# EAGLE design PIC18f26k40_W5500_DevBoard (EAGLE 8.0.1)
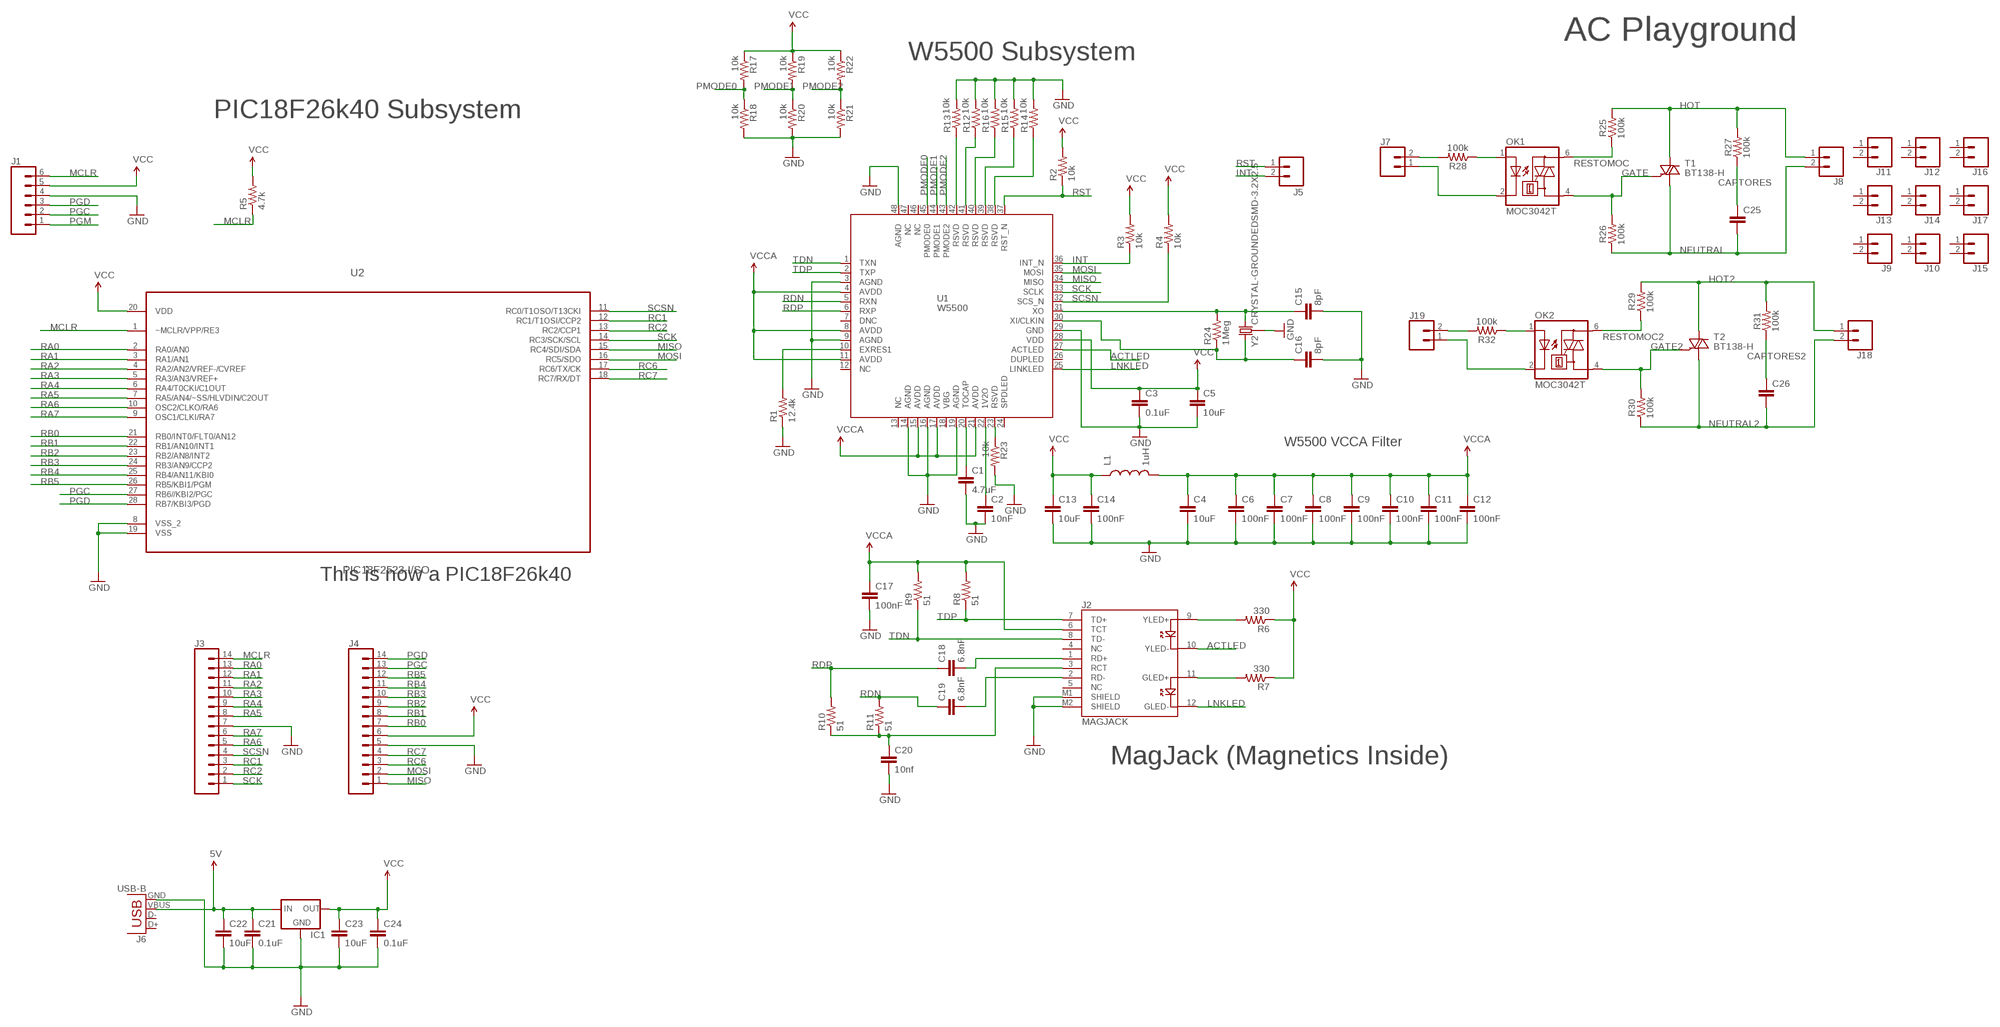
[diagram p0: schematic, sheet 1]

## Parts
C1  4.7uF  CAP0603-CAP  [0603-CAP]
C2  10nF  CAP0603-CAP  [0603-CAP]
C3  0.1uF  CAP0603-CAP  [0603-CAP]
C4  10uF  CAP0603-CAP  [0603-CAP]
C5  10uF  CAP0603-CAP  [0603-CAP]
C6  100nF  CAP0603-CAP  [0603-CAP]
C7  100nF  CAP0603-CAP  [0603-CAP]
C8  100nF  CAP0603-CAP  [0603-CAP]
C9  100nF  CAP0603-CAP  [0603-CAP]
C10  100nF  CAP0603-CAP  [0603-CAP]
C11  100nF  CAP0603-CAP  [0603-CAP]
C12  100nF  CAP0603-CAP  [0603-CAP]
C13  10uF  CAP0603-CAP  [0603-CAP]
C14  100nF  CAP0603-CAP  [0603-CAP]
C15  8pF  CAP0603-CAP  [0603-CAP]
C16  8pF  CAP0603-CAP  [0603-CAP]
C17  100nF  CAP0603-CAP  [0603-CAP]
C18  6.8nF  CAP0603-CAP  [0603-CAP]
C19  6.8nF  CAP0603-CAP  [0603-CAP]
C20  10nf  CAP0603-CAP  [0603-CAP]
C21  0.1uF  CAP0603-CAP  [0603-CAP]
C22  10uF  CAP0603-CAP  [0603-CAP]
C23  10uF  CAP0603-CAP  [0603-CAP]
C24  0.1uF  CAP0603-CAP  [0603-CAP]
C25  CAPPTH3  [CAP-PTH-LARGE]
C26  CAPPTH3  [CAP-PTH-LARGE]
IC1  78XXL  [78XXL]
J1  CONN_06NO_SILK_FEMALE_PTH  [1X06_NO_SILK]
J2  MAGJACK  [MAGJACK]
J3  CONN_14  [1X14]
J4  CONN_14  [1X14]
J5  M02PTH  [1X02@1]
J6  USB-B  USBPTH  [USB-B-PTH]
J7  CONN_02  [1X02]
J8  CONN_025MM  [SCREWTERMINAL-5MM-2]
J9  CONN_025MM  [SCREWTERMINAL-5MM-2]
J10  CONN_025MM  [SCREWTERMINAL-5MM-2]
J11  CONN_025MM  [SCREWTERMINAL-5MM-2]
J12  CONN_025MM  [SCREWTERMINAL-5MM-2]
J13  CONN_025MM  [SCREWTERMINAL-5MM-2]
J14  CONN_025MM  [SCREWTERMINAL-5MM-2]
J15  CONN_025MM  [SCREWTERMINAL-5MM-2]
J16  CONN_025MM  [SCREWTERMINAL-5MM-2]
J17  CONN_025MM  [SCREWTERMINAL-5MM-2]
J18  CONN_025MM  [SCREWTERMINAL-5MM-2]
J19  CONN_02  [1X02]
L1  1uH  INDUCTOR0603  [0603]
OK1  MOC3042T  [DIL06B]
OK2  MOC3042T  [DIL06B]
R1  12.4k  RESISTOR0603-RES  [0603-RES]
R2  10k  RESISTOR0603-RES  [0603-RES]
R3  10k  RESISTOR0603-RES  [0603-RES]
R4  10k  RESISTOR0603-RES  [0603-RES]
R5  4.7k  RESISTOR0603-RES  [0603-RES]
R6  330  RESISTOR0603-RES  [0603-RES]
R7  330  RESISTOR0603-RES  [0603-RES]
R8  51  RESISTOR0603-RES  [0603-RES]
R9  51  RESISTOR0603-RES  [0603-RES]
R10  51  RESISTOR0603-RES  [0603-RES]
R11  51  RESISTOR0603-RES  [0603-RES]
R12  10k  RESISTOR0603-RES  [0603-RES]
R13  10k  RESISTOR0603-RES  [0603-RES]
R14  10k  RESISTOR0603-RES  [0603-RES]
R15  10k  RESISTOR0603-RES  [0603-RES]
R16  10k  RESISTOR0603-RES  [0603-RES]
R17  10k  RESISTOR0603-RES  [0603-RES]
R18  10k  RESISTOR0603-RES  [0603-RES]
R19  10k  RESISTOR0603-RES  [0603-RES]
R20  10k  RESISTOR0603-RES  [0603-RES]
R21  10k  RESISTOR0603-RES  [0603-RES]
R22  10k  RESISTOR0603-RES  [0603-RES]
R23  10k  RESISTOR0603-RES  [0603-RES]
R24  1Meg  RESISTOR0603-RES  [0603-RES]
R25  100k  100KOHM-HORIZ-1/4W-1%  [AXIAL-0.3]
R26  100k  100KOHM-HORIZ-1/4W-1%  [AXIAL-0.3]
R27  100k  100KOHM-HORIZ-1/4W-1%  [AXIAL-0.3]
R28  100k  100KOHM-HORIZ-1/4W-1%  [AXIAL-0.3]
R29  100k  100KOHM-HORIZ-1/4W-1%  [AXIAL-0.3]
R30  100k  100KOHM-HORIZ-1/4W-1%  [AXIAL-0.3]
R31  100k  100KOHM-HORIZ-1/4W-1%  [AXIAL-0.3]
R32  100k  100KOHM-HORIZ-1/4W-1%  [AXIAL-0.3]
T1  BT138-H  [TO220BH]
T2  BT138-H  [TO220BH]
U1  W5500  [W5500]
U2  PIC18F2523-I/SO  [SOIC127P1030X265-28N]
Y2  CRYSTAL-GROUNDEDSMD-3.2X2.5  [CRYSTAL-SMD-3.2X2.5MM]

## Nets
5V: C21.1 C22.1 IC1.IN J6.VBUS
ACTLED: J2.10(YLED-) U1.27(ACTLED)
CAPTORES: C25.1 R27.P$1
CAPTORES2: C26.1 R31.P$1
GATE: OK1.4(A1) R26.P$2 T1.G
GATE2: OK2.4(A1) R30.P$2 T2.G
GND: C1.2 C2.2 C3.2 C4.2 C5.2 C6.2 C7.2 C8.2 C9.2 C10.2 C11.2 C12.2 C13.2 C14.2 C15.2 C16.2 C17.2 C20.2 C21.2 C22.2 C23.2 C24.2 IC1.GND J1.4 J2.M1(SHIELD) J2.M2(SHIELD) J3.7 J4.5 J6.GND R1.1 R12.2 R13.2 R14.2 R15.2 R16.2 R18.2 R20.2 R21.2 R23.2 U1.3(AGND) U1.9(AGND) U1.14(AGND) U1.16(AGND) U1.19(AGND) U1.29(GND) U1.48(AGND) U2.8(VSS_2) U2.19(VSS) Y2.2 Y2.4
HOT: J8.1 R25.P$2 R27.P$2 T1.T2(A2)
HOT2: J18.1 R29.P$2 R31.P$2 T2.T2(A2)
INT: J5.2 R3.1 U1.36(INT_N)
LNKLED: J2.12(GLED-) U1.25(LINKLED)
MCLR: J1.6 J3.14 R5.1 U2.1(~MCLR/VPP/RE3)
MISO: J4.1 U1.34(MISO) U2.15(RC4/SDI/SDA)
MOSI: J4.2 U1.35(MOSI) U2.16(RC5/SDO)
N$1: C1.1 U1.20(TOCAP)
N$2: C2.1 U1.22(1V2O)
N$3: R12.1 U1.41(RSVD)
N$4: R1.2 U1.10(EXRES1)
N$5: J7.2 R28.P$2
N$6: C15.1 R24.2 U1.31(XO) Y2.3
N$7: J2.9(YLED+) R6.2
N$8: C18.2 J2.1(RD+)
N$9: J2.11(GLED+) R7.2
N$10: C19.2 J2.2(RD-)
N$11: C20.1 J2.3(RCT) R10.1 R11.1
N$12: R14.1 U1.38(RSVD)
N$13: R15.1 U1.39(RSVD)
N$14: R16.1 U1.40(RSVD)
N$15: R13.1 U1.42(RSVD)
N$16: R23.1 U1.23(RSVD)
N$17: C16.1 R24.1 U1.30(XI/CLKIN) Y2.1
N$18: OK1.1(A) R28.P$1
N$19: J7.1 OK1.2(C)
N$20: J19.2 R32.P$2
N$21: OK2.1(A) R32.P$1
N$22: J19.1 OK2.2(C)
NEUTRAL: C25.2 J8.2 R26.P$1 T1.T1(A1)
NEUTRAL2: C26.2 J18.2 R30.P$1 T2.T1(A1)
PGC: J1.2 J4.13 U2.27(RB6//KBI2/PGC)
PGD: J1.3 J4.14 U2.28(RB7/KBI3/PGD)
PGM: J1.1
PMODE0: R17.2 R18.1 U1.45(PMODE0)
PMODE1: R19.2 R20.1 U1.44(PMODE1)
PMODE2: R21.1 R22.2 U1.43(PMODE2)
RA0: J3.13 U2.2(RA0/AN0)
RA1: J3.12 U2.3(RA1/AN1)
RA2: J3.11 U2.4(RA2/AN2/VREF-/CVREF)
RA3: J3.10 U2.5(RA3/AN3/VREF+)
RA4: J3.9 U2.6(RA4/T0CKI/C1OUT)
RA5: J3.8 U2.7(RA5/AN4/~SS/HLVDIN/C2OUT)
RA6: J3.5 U2.10(OSC2/CLKO/RA6)
RA7: J3.6 U2.9(OSC1/CLKI/RA7)
RB0: J4.7 U2.21(RB0/INT0/FLT0/AN12)
RB1: J4.8 U2.22(RB1/AN10/INT1)
RB2: J4.9 U2.23(RB2/AN8/INT2)
RB3: J4.10 U2.24(RB3/AN9/CCP2)
RB4: J4.11 U2.25(RB4/AN11/KBI0)
RB5: J4.12 U2.26(RB5/KBI1/PGM)
RC1: J3.3 U2.12(RC1/T1OSI/CCP2)
RC2: J3.2 U2.13(RC2/CCP1)
RC6: J4.3 U2.17(RC6/TX/CK)
RC7: J4.4 U2.18(RC7/RX/DT)
RDN: C19.1 R11.2 U1.5(RXN)
RDP: C18.1 R10.2 U1.6(RXP)
RESTOMOC: OK1.6(A2) R25.P$1
RESTOMOC2: OK2.6(A2) R29.P$1
RST: J5.1 R2.1 U1.37(RST_N)
SCK: J3.1 U1.33(SCLK) U2.14(RC3/SCK/SCL)
SCSN: J3.4 R4.1 U1.32(SCS_N) U2.11(RC0/T1OSO/T13CKI)
TDN: J2.8(TD-) R9.1 U1.1(TXN)
TDP: J2.7(TD+) R8.1 U1.2(TXP)
VCC: C3.1 C5.1 C13.1 C14.1 C23.1 C24.1 IC1.OUT J1.5 J4.6 L1.1 R2.2 R3.2 R4.2 R5.2 R6.1 R7.1 R17.1 R19.1 R22.1 U1.28(VDD) U2.20(VDD)
VCCA: C4.1 C6.1 C7.1 C8.1 C9.1 C10.1 C11.1 C12.1 C17.1 J2.6(TCT) L1.2 R8.2 R9.2 U1.4(AVDD) U1.8(AVDD) U1.11(AVDD) U1.15(AVDD) U1.17(AVDD) U1.21(AVDD)
Unconnected: J2.4(NC) J2.5(NC) J6.D+ J6.D- J9.1 J9.2 J10.1 J10.2 J11.1 J11.2 J12.1 J12.2 J13.1 J13.2 J14.1 J14.2 J15.1 J15.2 J16.1 J16.2 J17.1 J17.2 U1.7(DNC) U1.12(NC) U1.13(NC) U1.18(VBG) U1.24(SPDLED) U1.26(DUPLED) U1.46(NC) U1.47(NC)

## Notes on the sheet
- AC Playground
- W5500 Subsystem
- PIC18F26k40 Subsystem
- W5500 VCCA Filter
- This is now a PIC18F26k40
- MagJack (Magnetics Inside)

## Library data of the parts
C1-C24 = SparkFun-Passives:CAP: Capacitor Standard 0603 ceramic capacitor, and 0.1" leaded capacitor.
C25 C26 = SparkFun-Capacitors:CAP: Capacitor Standard 0603 ceramic capacitor, and 0.1" leaded capacitor.
IC1 = v-reg:78XXL: VOLTAGE REGULATOR
J1 = SparkFun-Connectors:CONN_06: Multi connection point. Often used as Generic Header-pin footprint for 0.1 inch spaced/style header connections On any of the 0.1 inch spaced packages, you can populate with these: Break Away Headers - Straight <https://www.sparkfun.com/products/116> (PRT-00116) Break Away Male Headers - Right Angle <https://www.sparkfun.com/products/553> (PRT-00553) Female Headers <https://www.sparkfun.com/products/115> (PRT-00115) Break Away Headers - Machine Pin <https://www.sparkfun.com/products/117> (PRT-00117) Break Away Female Headers - Swiss Machine Pin <https://www.sparkfun.com/products/743> (PRT-00743) Arduino Stackable Header - 6 Pin <https://www.sparkfun.com/products/9280> (PRT-09280) For SCREWTERMINALS and SPRING TERMINALS visit here: Screw Terimnals on SparkFun.com <https://www.sparkfun.com/search/results?term=Screw+Terminals> (5mm/3.5mm/2.54mm spacing) This device is also useful as a general connection point to wire up your design to another part of your project. Our various solder wires solder well into these plated through hole pads. Hook-Up Wire - Assortment (Stranded, 22 AWG) <https://www.sparkfun.com/products/11375> (PRT-11375) Hook-Up Wire - Assortment (Solid Core, 22 AWG) <https://www.sparkfun.com/products/11367> (PRT-11367) View the entire wire category on our website here <https://www.sparkfun.com/categories/141>; PROD_ID: CONN-08437
J2 = SparkFun-Connectors:MAGJACK: MAGJACK: RJ-45 with LEDs This is a single port, RJ45 ethernet jacks with built in transformer (magnetics), status LEDs, and shielding. Here is the connector we sell at SparkFun: RJ45 Ethernet MagJack-Compatible <https://www.sparkfun.com/products/8534> (PRT-08534) Datasheet <http://www.sparkfun.com/datasheets/Prototyping/MagJack.pdf> It is used on this SparkFun product: SparkFun RJ45 MagJack Breakout <https://www.sparkfun.com/products/13021> (BOB-13021); PROD_ID: CONN-09556; SF_ID: PRT-08534
J3 J4 = SparkFun-Connectors:CONN_14: Multi connection point. Often used as Generic Header-pin footprint for 0.1 inch spaced/style header connections On any of the 0.1 inch spaced packages, you can populate with these: Break Away Headers - Straight <https://www.sparkfun.com/products/116> (PRT-00116) Break Away Male Headers - Right Angle <https://www.sparkfun.com/products/553> (PRT-00553) Female Headers <https://www.sparkfun.com/products/115> (PRT-00115) Break Away Headers - Machine Pin <https://www.sparkfun.com/products/117> (PRT-00117) Break Away Female Headers - Swiss Machine Pin <https://www.sparkfun.com/products/743> (PRT-00743) For SCREWTERMINALS and SPRING TERMINALS visit here: Screw Terimnals on SparkFun.com <https://www.sparkfun.com/search/results?term=Screw+Terminals> (5mm/3.5mm/2.54mm spacing) This device is also useful as a general connection point to wire up your design to another part of your project. Our various solder wires solder well into these plated through hole pads. Hook-Up Wire - Assortment (Stranded, 22 AWG) <https://www.sparkfun.com/products/11375> (PRT-11375) Hook-Up Wire - Assortment (Solid Core, 22 AWG) <https://www.sparkfun.com/products/11367> (PRT-11367) View the entire wire category on our website here <https://www.sparkfun.com/categories/141> Special notes: Molex polarized connector foot print use with SKU : PRT-08231 with associated crimp pins and housings. 1MM SMD Version SKU: PRT-10208 NOTES ON THE VARIANTS LOCK and LOCK_LONGPADS... This footprint was designed to help hold the alignment of a through-hole component (i.e. 6-pin header) while soldering it into place. You may notice that each hole has been shifted either up or down by 0.005 of an inch from it's more standard position (which is a perfectly straight line). This slight alteration caused the pins (the squares in the middle) to touch the edges of the holes. Because they are alternating, it causes a "brace" to hold the component in place. 0.005 has proven to be the perfect amount of "off-center" position when using our standard breakaway headers. Although looks a little odd when you look at the bare footprint, once you have a header in there, the alteration is very hard to notice. Also,if you push a header all the way into place, it is covered up entirely on the bottom side.
J5 = SparkFun-Connectors:M02: Standard 2-pin 0.1" header. Use with - straight break away headers ( PRT-00116) - right angle break away headers (PRT-00553) - swiss pins (PRT-00743) - machine pins (PRT-00117) - female headers (PRT-00115) Molex polarized connector foot print use with: PRT-08233 with associated crimp pins and housings. 2.54_SCREWTERM for use with PRT-10571. 3.5mm Screw Terminal footprints for PRT-08084 5mm Screw Terminal footprints for use with PRT-08432
J6 = SparkFun-Connectors:USB: USB Connectors USB-B-PTH is fully proven SKU : PRT-00139/CONN-08278 USB-miniB is fully proven SKU : PRT-00587 USB-A-PCB is untested. USB-A-H is throughly reviewed, but untested. Spark Fun Electronics SKU : PRT-00437 USB-B-SMT is throughly reviewed, but untested. Needs silkscreen touching up. USB-A-S has not been used/tested USB-MB-H has not been used/tested USB-MICROB has been used. CONN-09505; PROD_ID: CONN-08278
J7 J19 = SparkFun-Connectors:CONN_02: Multi connection point. Often used as Generic Header-pin footprint for 0.1 inch spaced/style header connections On any of the 0.1 inch spaced packages, you can populate with these: Break Away Headers - Straight <https://www.sparkfun.com/products/116> (PRT-00116) Break Away Male Headers - Right Angle <https://www.sparkfun.com/products/553> (PRT-00553) Female Headers <https://www.sparkfun.com/products/115> (PRT-00115) Break Away Headers - Machine Pin <https://www.sparkfun.com/products/117> (PRT-00117) Break Away Female Headers - Swiss Machine Pin <https://www.sparkfun.com/products/743> (PRT-00743) For SCREWTERMINALS and SPRING TERMINALS visit here: Screw Terimnals on SparkFun.com <https://www.sparkfun.com/search/results?term=Screw+Terminals> (5mm/3.5mm/2.54mm spacing) This device is also useful as a general connection point to wire up your design to another part of your project. Our various solder wires solder well into these plated through hole pads. Hook-Up Wire - Assortment (Stranded, 22 AWG) <https://www.sparkfun.com/products/11375> (PRT-11375) Hook-Up Wire - Assortment (Solid Core, 22 AWG) <https://www.sparkfun.com/products/11367> (PRT-11367) View the entire wire category on our website here <https://www.sparkfun.com/categories/141> Special notes: Molex polarized connector foot print use with: PRT-08233 with associated crimp pins and housings. 2.54_SCREWTERM for use with PRT-10571. 3.5mm Screw Terminal footprints for PRT-08084 5mm Screw Terminal footprints for use with PRT-08432
J8-J18 = SparkFun-Connectors:CONN_02: Multi connection point. Often used as Generic Header-pin footprint for 0.1 inch spaced/style header connections On any of the 0.1 inch spaced packages, you can populate with these: Break Away Headers - Straight <https://www.sparkfun.com/products/116> (PRT-00116) Break Away Male Headers - Right Angle <https://www.sparkfun.com/products/553> (PRT-00553) Female Headers <https://www.sparkfun.com/products/115> (PRT-00115) Break Away Headers - Machine Pin <https://www.sparkfun.com/products/117> (PRT-00117) Break Away Female Headers - Swiss Machine Pin <https://www.sparkfun.com/products/743> (PRT-00743) For SCREWTERMINALS and SPRING TERMINALS visit here: Screw Terimnals on SparkFun.com <https://www.sparkfun.com/search/results?term=Screw+Terminals> (5mm/3.5mm/2.54mm spacing) This device is also useful as a general connection point to wire up your design to another part of your project. Our various solder wires solder well into these plated through hole pads. Hook-Up Wire - Assortment (Stranded, 22 AWG) <https://www.sparkfun.com/products/11375> (PRT-11375) Hook-Up Wire - Assortment (Solid Core, 22 AWG) <https://www.sparkfun.com/products/11367> (PRT-11367) View the entire wire category on our website here <https://www.sparkfun.com/categories/141> Special notes: Molex polarized connector foot print use with: PRT-08233 with associated crimp pins and housings. 2.54_SCREWTERM for use with PRT-10571. 3.5mm Screw Terminal footprints for PRT-08084 5mm Screw Terminal footprints for use with PRT-08432; SF_SKU: PRT-08432
L1 = SparkFun-Passives:INDUCTOR: Inductors Basic Inductor/Choke - 0603 and 1206. Footprints are not proven and vary greatly between part numbers. INDUCTOR POWER 3.3UH 4.0A SMD 0.197" L x 0.197" W x 0.177" H (5.00mm x 5.00mm x 4.50mm)
OK1 OK2 = optocoupler:MOC30*: 6-Pin DIP Zero-Cross Optoisolators Triac Driver Output (250/400 Volt Peak) Source: Data sheet <http://www.fairchildsemi.com/ds/MO/MOC3031M.pdf> The old path of data sheet not more available 2013-05-06.; OC_FARNELL: unknown; OC_NEWARK: unknown
R1-R24 = SparkFun-Passives:RESISTOR: Resistor Basic schematic elements and footprints for 0603, 1206, and PTH resistors.
R25-R32 = SparkFun-Resistors:100KOHM: 100kΩ resistor A resistor is a passive two-terminal electrical component that implements electrical resistance as a circuit element. Resistors act to reduce current flow, and, at the same time, act to lower voltage levels within circuits. - Wikipedia; PROD_ID: RES-12184
T1 T2 = triac:BT138: TRIAC Source: http://www.semiconductors.philips.com BT138_SERIES_2.pdf
U1 = W5500:W5500
U2 = Microchip_By_element14_Batch_1:PIC18F2523-I/SO: Enhanced Flash Microcontroller; MPN: PIC18F2523-I/SO; OC_FARNELL: 1332244; OC_NEWARK: 88K5996; PACKAGE: SOIC-28; SUPPLIER: Microchip
Y2 = SparkFun-Clocks:CRYSTAL-GROUNDED: Crystals w/ Ground Pin (Generic) These are passive quartz crystals, which can be used as a clock source for a microcontroller. Crystal's are usually two-terminal devices. A third terminal may be optionally connected to ground, as recommended by the manufaturer.

## Board
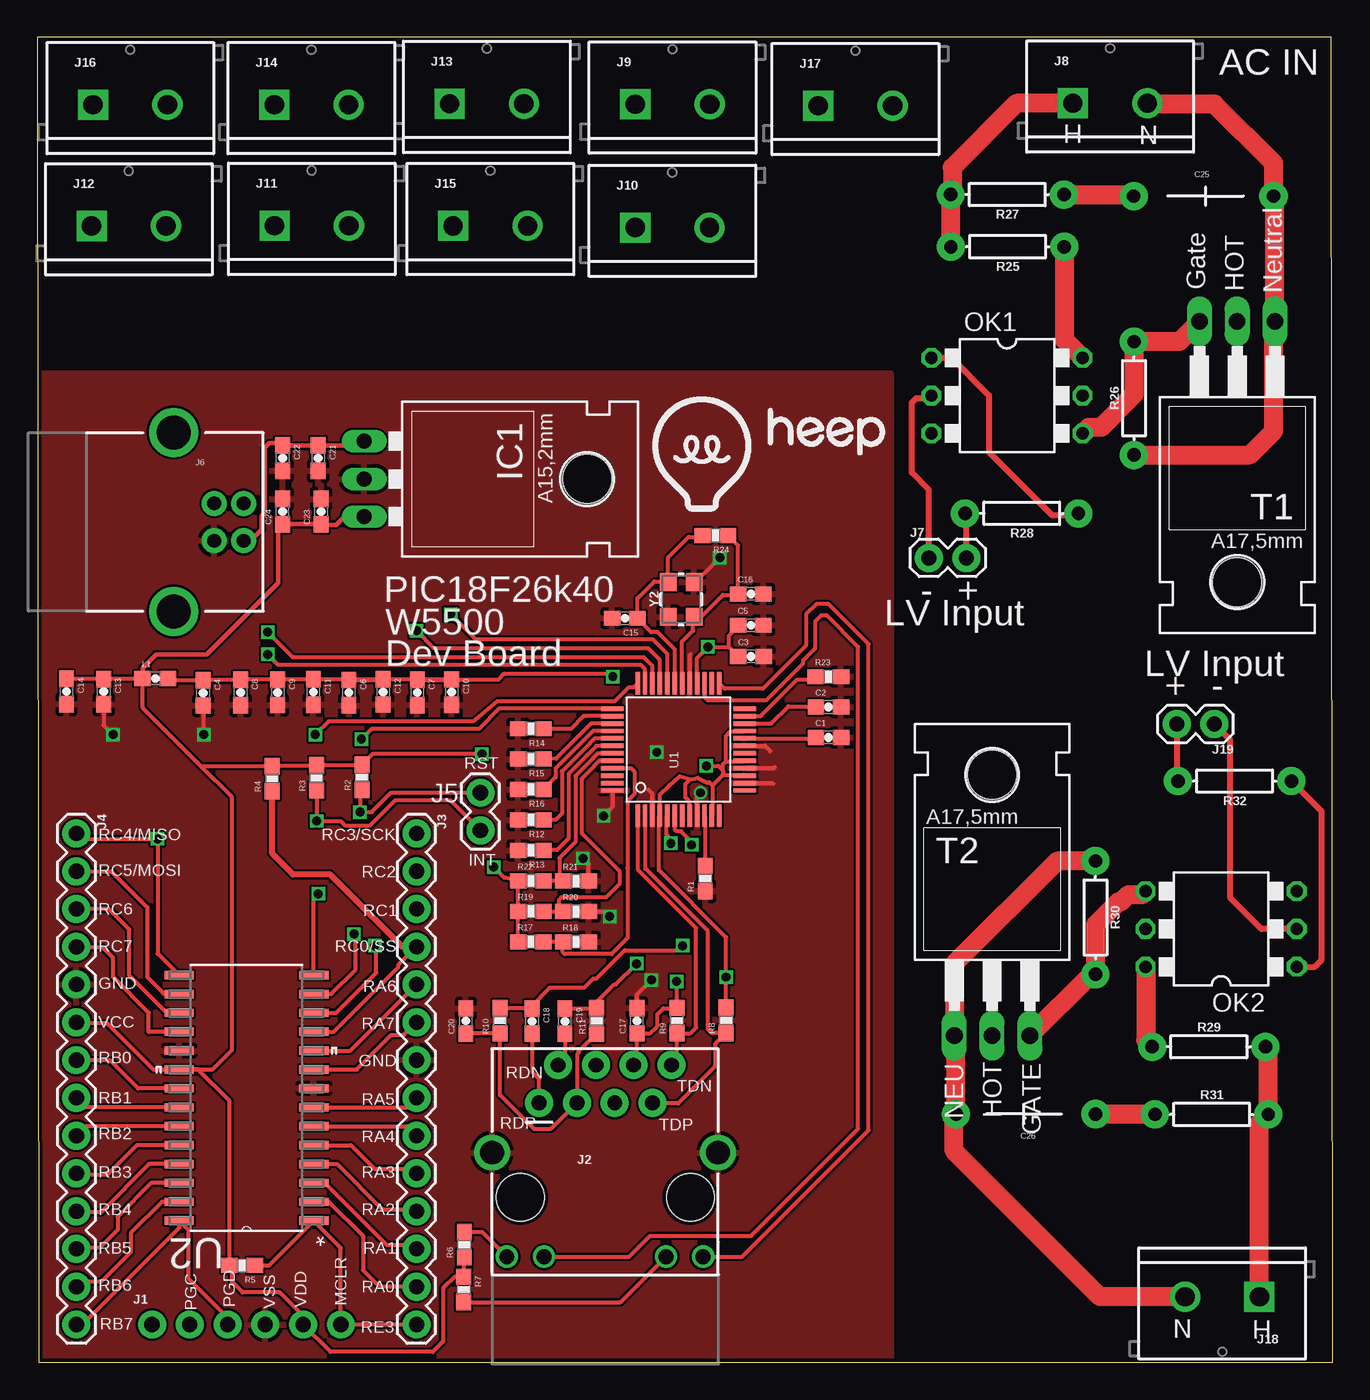
[diagram p1: board, top side]
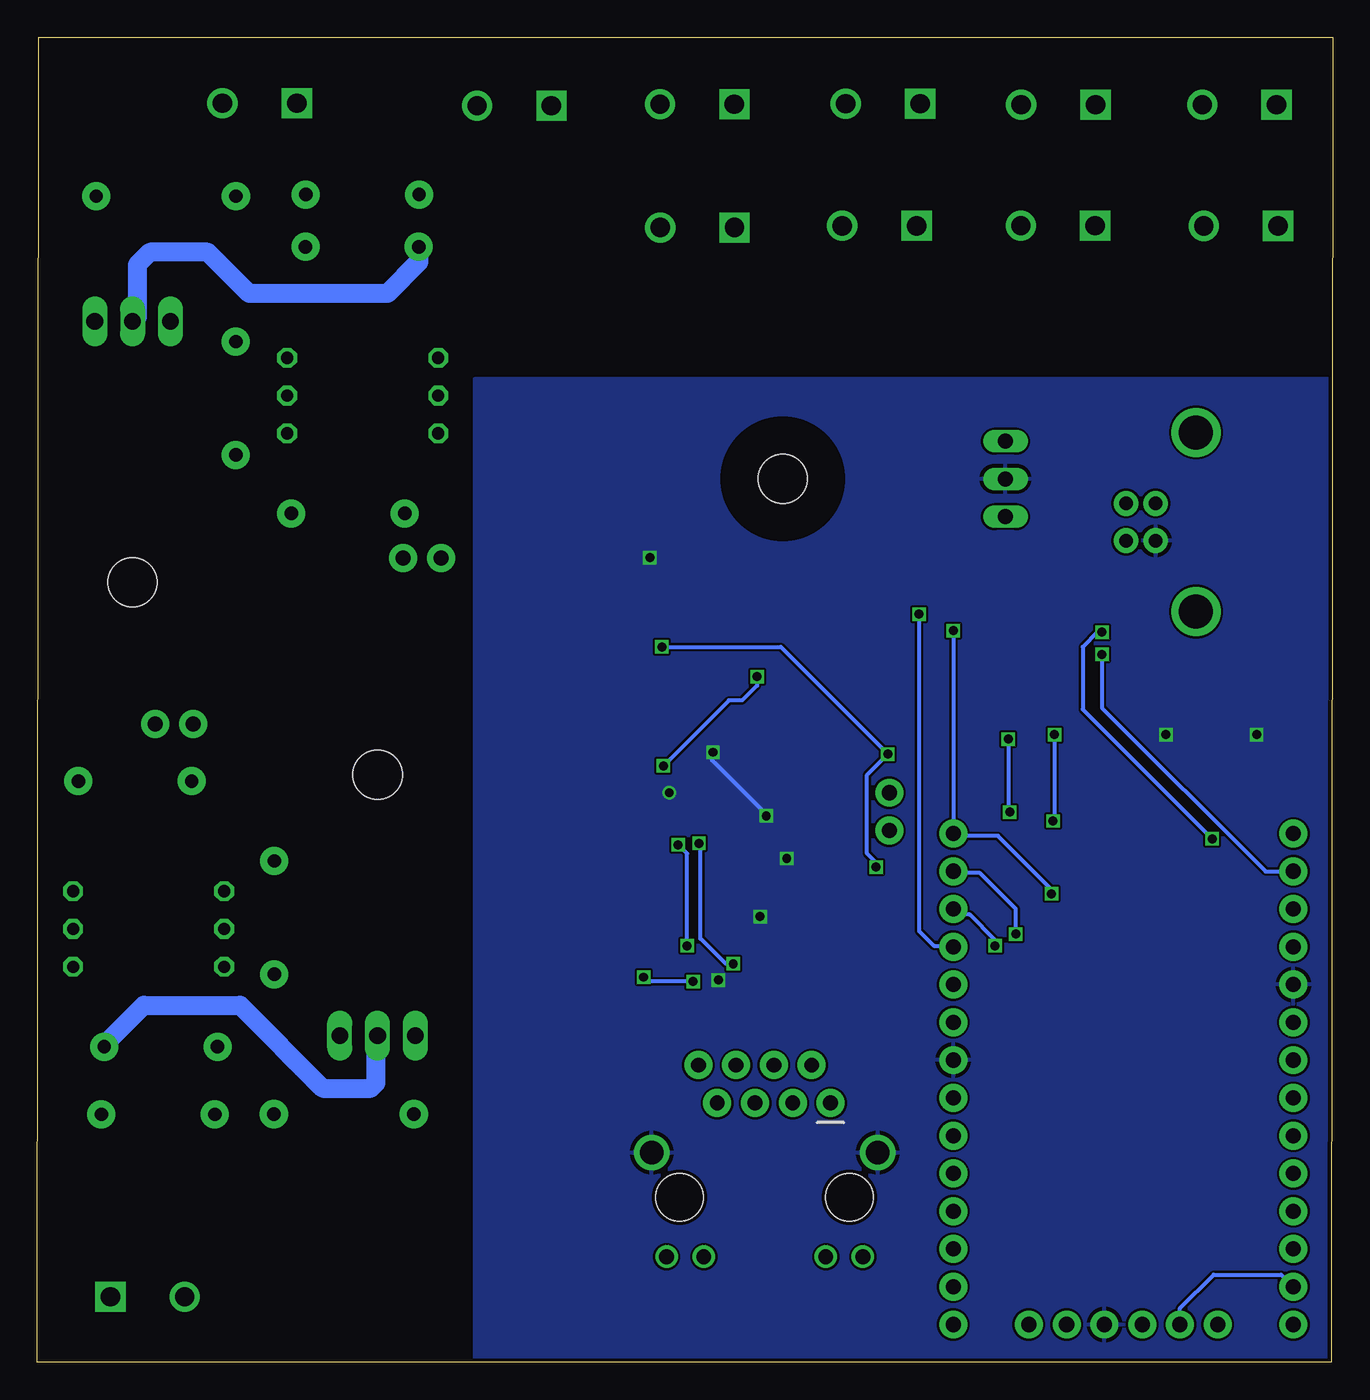
[diagram p2: board, bottom side, seen from below]

Size 87.1 x 89.1 mm. Coordinates in mm from the lower left corner, seen from the top.
Outline: 0.1,0 87.1,0 87,89.1 0,89.1 0.1,0
Copper layers (1*16): Top 0.035mm / dielectric 1.5mm / Bottom 0.035mm
Design rules "SeeedStudio_2layer_DRU_no_angle_20140221": minimum track width 6mil, minimum drill 12mil, track to track 6mil, track to pad 6mil, pad to pad 6mil, via to via 6mil, smd to smd 0mil, copper to edge 10mil, drill to drill 10mil, minimum pad ring 10mil, minimum via ring 6mil, stop-mask expansion 2mil, vias tented up to drill 100mil, thermal gap 10mil

### Footprints (pad centres in the part's own frame; a part is rotated, then mirrored left to right if it is on the bottom)
0603-CAP = smd 1.1 x 1: 1 -0.85,0; 2 0.85,0
CAP-PTH-LARGE = drill 0.9 pad 1.905: 1 -4.826,0; 2 4.572,0
78XXL = drill 1.016 long: GND 0,-3.81; IN -2.54,-3.81; OUT 2.54,-3.81 | hole 3.302: 0,11.176
1X06_NO_SILK = drill 1.016 pad 1.88: 1 0,0; 2 2.54,0; 3 5.08,0; 4 7.62,0; 5 10.16,0; 6 12.7,0
MAGJACK = drill 1 pad 1.88: 1 3.175,17.445; 2 4.445,19.985; 3 5.715,17.445; 4 6.985,19.985; 5 8.255,17.445; 6 9.525,19.985; 7 10.795,17.445; 8 12.065,19.985 | drill 1 pad 1.27: 9 1,7.1; 10 3.5,7.1; 11 11.7,7.1; 12 14.2,7.1 | drill 1.6 pad 2.184: M1 0,14.1; M2 15.2,14.1 | hole 3.2: 1.905,11.095; 13.335,11.095
1X14 = drill 1.016 pad 1.88: 1 0,0; 2 2.54,0; 3 5.08,0; 4 7.62,0; 5 10.16,0; 6 12.7,0; 7 15.24,0; 8 17.78,0; 9 20.32,0; 10 22.86,0; 11 25.4,0; 12 27.94,0; 13 30.48,0; 14 33.02,0
1X02@1 = drill 1.016 pad 1.88: 1 0,0; 2 2.54,0
USB-B-PTH = drill 0.914 pad 1.676: D+ 0,1.25; D- 1.981,1.25; GND 0,-1.25; VBUS 1.981,-1.25 | drill 2.286: S1 -2.718,-6.02; S2 -2.718,6.02
1X02 = drill 1.016 pad 1.88: 1 0,0; 2 2.54,0
SCREWTERMINAL-5MM-2 = drill 1.3 pad 2.032 square: 1 0,0 | drill 1.3 pad 2.032: 2 5,0
0603 = smd 1.1 x 1: 1 -0.85,0; 2 0.85,0
DIL06B = drill 0.813 octagon: 1 -2.54,-5.08; 2 0,-5.08; 3 2.54,-5.08; 4 2.54,5.08; 5 0,5.08; 6 -2.54,5.08
0603-RES = smd 1.1 x 1: 1 -0.85,0; 2 0.85,0
AXIAL-0.3 = drill 0.9 pad 1.88: P$1 -3.81,0; P$2 3.81,0
TO220BH = drill 1.118 long: G 2.54,-6.35; T1 -2.54,-6.35; T2 0,-6.35 | hole 3.302: 0,11.176
W5500 = smd 1.5 x 0.3: 1 -4.45,2.75; 2 -4.45,2.25; 3 -4.45,1.75; 4 -4.45,1.25; 5 -4.45,0.75; 6 -4.45,0.25; 7 -4.45,-0.25; 8 -4.45,-0.75; 9 -4.45,-1.25; 10 -4.45,-1.75; 11 -4.45,-2.25; 12 -4.45,-2.75; 25 4.45,-2.75; 26 4.45,-2.25; 27 4.45,-1.75; 28 4.45,-1.25; 29 4.45,-0.75; 30 4.45,-0.25; 31 4.45,0.25; 32 4.45,0.75; 33 4.45,1.25; 34 4.45,1.75; 35 4.45,2.25; 36 4.45,2.75 | smd 0.3 x 1.5: 13 -2.75,-4.45; 14 -2.25,-4.45; 15 -1.75,-4.45; 16 -1.25,-4.45; 17 -0.75,-4.45; 18 -0.25,-4.45; 19 0.25,-4.45; 20 0.75,-4.45; 21 1.25,-4.45; 22 1.75,-4.45; 23 2.25,-4.45; 24 2.75,-4.45; 37 2.75,4.45; 38 2.25,4.45; 39 1.75,4.45; 40 1.25,4.45; 41 0.75,4.45; 42 0.25,4.45; 43 -0.25,4.45; 44 -0.75,4.45; 45 -1.25,4.45; 46 -1.75,4.45; 47 -2.25,4.45; 48 -2.75,4.45
SOIC127P1030X265-28N = smd 1.981 x 0.559: 1 -4.521,8.255; 2 -4.521,6.985; 3 -4.521,5.715; 4 -4.521,4.445; 5 -4.521,3.175; 6 -4.521,1.905; 7 -4.521,0.635; 8 -4.521,-0.635; 9 -4.521,-1.905; 10 -4.521,-3.175; 11 -4.521,-4.445; 12 -4.521,-5.715; 13 -4.521,-6.985; 14 -4.521,-8.255; 15 4.521,-8.255; 16 4.521,-6.985; 17 4.521,-5.715; 18 4.521,-4.445; 19 4.521,-3.175; 20 4.521,-1.905; 21 4.521,-0.635; 22 4.521,0.635; 23 4.521,1.905; 24 4.521,3.175; 25 4.521,4.445; 26 4.521,5.715; 27 4.521,6.985; 28 4.521,8.255
CRYSTAL-SMD-3.2X2.5MM = smd 1.2 x 1.1: 1 -1.175,-0.875; 2 1.175,-0.875; 3 1.175,0.875; 4 -1.175,0.875

### Placement (x,y rotation side)
C1  53.21,42.02 0 top
C2  53.21,44.06 0 top
C3  48,47.46 0 top
C4  11.16,45.01 270 top
C5  47.98,49.56 0 top
C6  20.96,45.03 270 top
C7  25.56,45.04 270 top
C8  13.67,45.04 270 top
C9  16.17,45.05 270 top
C10  27.87,45.06 270 top
C11  18.57,45.07 270 top
C12  23.27,45.08 270 top
C13  4.47,45.09 270 top
C14  1.97,45.1 270 top
C15  39.51,50.03 180 top
C16  47.98,51.67 0 top
C17  40.33,22.97 90 top
C18  33.27,22.94 270 top
C19  35.48,22.94 270 top
C20  28.82,22.95 90 top
C21  18.9,60.8 270 top
C22  16.5,60.8 270 top
C23  19.1,57.2 90 top
C24  16.5,57.2 90 top
C25  78.56,78.41 0 top
C26  66.35,16.7 180 top
IC1  25.8,59.4 270 top
J1  7.72,2.54 0 top
J2  30.58,0 0 top
J3  25.5,35.56 270 top
J4  2.64,35.56 270 top
J5  29.8,38.3 270 top
J6  11.9,56.5 0 top
J7  59.95,54.09 0 top
J8  69.64,84.66 0 top
J9  40.22,84.59 0 top
J10  40.21,76.3 0 top
J11  15.96,76.43 0 top
J12  3.66,76.41 0 top
J13  27.73,84.63 0 top
J14  15.94,84.56 0 top
J15  27.97,76.42 0 top
J16  3.76,84.56 0 top
J17  52.52,84.49 0 top
J18  82.18,4.41 180 top
J19  79.16,42.92 180 top
L1  7.94,45.98 0 top
OK1  65.21,65 270 top
OK2  79.61,29.14 90 top
R1  44.92,32.53 90 top
R2  21.84,39.34 90 top
R3  18.79,39.3 90 top
R4  15.8,39.24 90 top
R5  13.78,6.52 180 top
R6  28.72,7.91 90 top
R7  28.68,4.9 270 top
R8  46.32,22.99 90 top
R9  43.02,22.98 90 top
R10  31.12,22.97 90 top
R11  37.62,22.96 90 top
R12  33.2,36.48 180 top
R13  33.2,34.43 180 top
R14  33.2,42.6 180 top
R15  33.2,40.57 180 top
R16  33.2,38.53 180 top
R17  33.19,28.28 0 top
R18  36.23,28.27 0 top
R19  33.2,30.33 0 top
R20  36.23,30.31 0 top
R21  36.23,32.36 0 top
R22  33.2,32.37 0 top
R23  53.2,46.1 0 top
R24  45.6,55.6 180 top
R25  65.25,75.01 180 top
R26  73.75,64.82 90 top
R27  65.23,78.52 180 top
R28  66.2,57.08 180 top
R29  78.78,21.22 0 top
R30  71.16,29.9 270 top
R31  78.97,16.67 0 top
R32  80.52,39.08 180 top
T1  80.69,63.63 180 top
T2  64.21,28.32 0 top
U1  43.12,41.2 90 top
U2  14.07,17.78 180 top
U$5  [HEEPLOGOSMALL]  40.2,56.4 0 top
U$6  [HEEPLETTERS]  48.3,60.5 0 top
Y2  43.3,51.3 90 top

### Tracks (layer width: path | path; a pad name or v marks a point on that pad's centre or on a via)
5V
  Top 0.305: J6.VBUS 14.35,55.25 15.1,56 15.1,56.9 15.3,57.1 15.3,61.5 15.6,61.8 16.35,61.8 C22.1 C21.1 21.7,61.65 IC1.IN
ACTLED
  Top 0.254: J2.10 39.8,7.1 41.2,8.5 48,8.5 55.2,15.7 55.2,48.1 53.1,50.2 52.7,50.2 52.3,49.8 52.3,48 51.5,47.2 51.5,47 49,44.5 45.1,44.5 44.9,44.7 44.9,45.62 U1.27
CAPTORES
  Top 1.27: R27.P$1 73.62,78.52 C25.1
CAPTORES2
  Top 1.27: R31.P$1 71.21,16.67 C26.1
GATE
  Top 1.27: T1.G 76.8,68.63 R26.P$2 73.75,65.09 71.52,62.86 70.69,62.86 OK1.4
GATE2
  Top 1.27: OK2.4 74.3,31.45 73.37,31.45 72.88,30.96 72.7,30.96 71.16,29.42 R30.P$2 70.87,26.09 T2.G
GND  (via drill 0.6, 0.6 pad 0.25)
  Top 0.254: U1.14 49.45,38.95 49.5,38.9 | U1.19 48.95,41.45 49.3,41.1 | U1.16 49.55,39.95 49.6,40 | U1.29 43.87,47.57 43.9,47.6 | C13.2 4.47,42.83 v5.1,42.2 | C4.2 11.16,42.24 v11.2,42.2 | Y2.2 44.27,52.48 v45.9,54.1 | U1.3 41.37,38.23 41.1,38.5 | 38.72,38.5 U1.48 38.67,37.33 v38.08,36.74 | 44.37,37.33 U1.9 44.37,38.07 v44.6,38.3 | C17.2 40.33,24.73 v41.3,25.7 | R21.2 37.08,33.5 v36.7,33.88 | R20.2 38.15,30.31 v38.49,29.97
  Bottom 0.254: v38.08,36.74 38.08,36.84 41.74,40.5 41.74,40.94 v41.66,41.02
  pour Top: -6.9,66.5 57.4,66.5 57.4,-9.6 -6.9,-9.6
  pour Bottom: -5.2,66.1 57.7,66.1 57.7,-8.6 -5.2,-8.6
HOT
  Top 1.27: J8.1 65.85,84.66 61.53,80.34 61.53,78.63 R27.P$2 61.42,75.03 R25.P$2
  Bottom 1.27: R25.P$2 61.44,73.99 63.57,71.86 72.84,71.86 75.62,74.64 79.52,74.64 80.37,73.79 80.37,70.3 T1.T2
HOT2
  Top 1.27: R29.P$2 82.78,21.03 R31.P$2 82.18,16.07 J18.1
  Bottom 1.27: R29.P$2 82.59,21.34 79.93,24 73.46,24 67.89,18.43 64.67,18.43 64.32,18.78 64.32,21.86 T2.T2
INT  (via drill 0.6)
  Top 0.254: v18.7,42.2 19.6,43.1 29.3,43.1 30.95,44.45 38.85,44.45 39.8,45.4 40.12,45.4 U1.36 | R3.1 v18.8,36.4 20.4,36.4 20.7,36.1 22.4,36.1 24.1,37.8 27.76,37.8 J5.2
  Bottom 0.254: v18.7,42.2 18.7,36.5 v18.8,36.4
LNKLED
  Top 0.254: J2.12 47.4,7.1 55.9,15.6 55.9,48.3 53.2,51 52.4,51 51.7,50.3 51.7,48.2 48.8,45.3 46.22,45.3 U1.25
MCLR
  Top 0.254: R5.1 15.59,6.52 U2.1 20.42,7.7 J1.6 J3.14
MISO  (via drill 0.6)
  Top 0.254: U1.34 41.37,46.83 40.8,47.4 17.2,47.4 v15.5,49.1 | J4.1 3,35.2 v8.1,35.2 8.1,27.48 U2.15
  Bottom 0.254: v15.5,49.1 15.8,49.1 16.8,48.1 16.8,43.9 v8.1,35.2
MOSI  (via drill 0.6)
  Top 0.254: U1.35 40.87,46.63 40.6,46.9 16.2,46.9 v15.5,47.6 | J4.2 4.98,33.02 7.4,30.6 7.4,25.9 8.5,24.8 9.51,24.8 U2.16
  Bottom 0.254: v15.5,47.6 15.5,44 4.5,33 2.66,33 J4.2
N$1
  Top 0.254: U1.20 52.26,41.95 C1.1
N$2
  Top 0.254: U1.22 49.35,42.95 50.5,44.1 52.32,44.1 C2.1
N$3
  Top 0.254: U1.41 37.49,41.95 37.14,41.6 37.14,41.59 35.29,39.74 35.29,36.92 34.84,36.47 R12.1
N$4
  Top 0.254: R1.2 44.92,36.7 U1.10
N$5
  Top 0.406: J7.2 62.49,56.98 R28.P$2
N$6
  Top 0.254: U1.31 42.87,47.93 41.7,49.1 41.29,49.1 C15.1 40.36,51.36 41.5,52.5 42.4,52.5 Y2.3 42.43,54.12 43.8,55.5 44.65,55.5 R24.2
N$7
  Top 0.254: R6.2 29.92,8.76 J2.9
N$8
  Top 0.254: J2.1 33.76,19.05 33.3,19.5 33.3,22.06 C18.2
N$9
  Top 0.254: R7.2 39.23,4.05 J2.11
N$10
  Top 0.254: C19.2 35.48,20.44 J2.2
N$11
  Top 0.254: R11.1 36.4,20.9 36.4,20.8 36.3,20.7 J2.3 34.55,15.7 33.4,15.7 31.12,17.98 R10.1 28.84,22.12 C20.1
N$12
  Top 0.254: U1.38 36.75,43.45 35.9,42.6 R14.1
N$13
  Top 0.254: U1.39 37.25,42.95 34.9,40.6 R15.1
N$14
  Top 0.254: U1.40 37.39,42.45 34.87,39.93 34.87,39.35 R16.1
N$15
  Top 0.254: U1.42 37.61,41.45 36.97,40.81 36.97,40.8 35.74,39.57 35.74,35.23 34.95,34.44 R13.1
N$16
  Top 0.254: U1.23 48.65,43.45 51.1,45.9 52.15,45.9 R23.1
N$17
  Top 0.254: U1.30 43.37,48.47 44.1,49.2 44.1,50.05 Y2.1 44.62,50.12 46.1,51.6 47.06,51.6 C16.1 47.13,54.92 R24.1
N$18
  Top 0.406: OK1.1 61.46,67.54 64,65 64,61.2 68.22,56.98 69.91,56.98 R28.P$1
N$19
  Top 0.406: J7.1 59.95,58.66 58.8,59.81 58.8,64.52 59.11,64.83 59.96,64.83 OK1.2
N$20
  Top 0.406: J19.2 76.62,39.17 R32.P$2
N$21
  Top 0.406: OK2.1 85.91,26.6 86.37,27.06 86.37,37.04 R32.P$1
N$22
  Top 0.406: OK2.2 82.31,29.14 80.22,31.23 80.22,41.86 J19.1
NEUTRAL
  Top 1.27: J8.2 74.7,84.6 79.16,84.6 83.13,80.63 C25.2 83.23,78.31 T1.T1 83.14,69.89 83.14,62.62 81.53,61.01 R26.P$1
NEUTRAL2
  Top 1.27: J18.2 71.46,4.41 61.64,14.23 61.64,16.56 C26.2 61.78,21.86 T2.T1 61.68,26.81 68.58,33.71 R30.P$1
PGC
  Top 0.254: U2.27 8.39,10.79 6.3,8.7 6.3,7.4 4.3,5.4 2.96,5.4 J4.13
  Bottom 0.254: J1.2 10.26,3.64 8,5.9 3.46,5.9 J4.13
PGD
  Top 0.254: J4.14 2.5,2.4 2.5,2 9.55,9.05 U2.28 10.2,8.87 10.2,5.6 12.8,3 J1.3
PMODE0
  Top 0.254: U1.45 39.93,39.95 40.15,39.73 40.15,38.2 39.7,37.75 39.7,33.22 39.69,33.21 39.69,28.52 38.62,27.45 35.47,27.45 35.34,27.58 35.34,28.23 R18.1 R17.2
PMODE1
  Top 0.254: U1.44 37.81,40.45 37.42,40.06 37.42,40.04 36.61,39.23 36.61,35.58 39.15,33.04 39.15,32.15 38.26,31.26 35.25,31.26 35.06,31.07 35.06,30.63 R20.1 35.36,30.33 R19.2
PMODE2
  Top 0.254: R22.2 R21.1 35.11,32.63 35.11,33.9 36.19,34.98 36.19,39.42 37.4,40.63 37.4,40.66 37.69,40.95 U1.43
RA0
  Top 0.254: U2.2 19.61,10.79 21.9,8.5 21.9,6.2 23,5.1 25.48,5.1 J3.13
RA1
  Top 0.254: U2.3 19.34,12.06 23.5,7.9 25.22,7.9 J3.12
RA2
  Top 0.254: U2.4 20.17,13.34 23.2,10.3 25.36,10.3 J3.11
RA3
  Top 0.254: U2.5 21.1,14.61 22.7,13 25.2,13 J3.10
RA4
  Top 0.254: U2.6 24.87,15.88 J3.9
RA5
  Top 0.254: U2.7 24.87,17.14 J3.8
RA6
  Top 0.254: U2.10 21.05,20.95 J3.5
RA7
  Top 0.254: U2.9 21.49,19.68 23.8,22 24.64,22 J3.6
RB0
  Top 0.254: U2.21 6.78,18.41 4.9,20.3 2.66,20.3 J4.7
RB1
  Top 0.254: U2.22 3.27,17.14 J4.8
RB2
  Top 0.254: U2.23 3.27,15.88 J4.9
RB3
  Top 0.254: U2.24 6.71,14.61 4.7,12.6 2.74,12.6 J4.10
RB4
  Top 0.254: U2.25 7.53,13.34 4.3,10.1 2.7,10.1 J4.11
RB5
  Top 0.254: U2.26 7.67,12.06 5.4,9.8 5.4,8.9 4.2,7.7 2.72,7.7 J4.12
RC1  (via drill 0.6)
  Top 0.254: U2.12 20.1,23.5 22.8,26.2 22.8,27.9 v22.7,28
  Bottom 0.254: v22.7,28 22.7,28.4 24.4,30.1 25.12,30.1 J3.3
RC2  (via drill 0.6)
  Top 0.254: U2.13 19.77,24.77 21.4,26.4 21.4,28.7 v21.3,28.8
  Bottom 0.254: v21.3,28.8 21.3,30.5 23.7,32.9 25.38,32.9 J3.2
RC6
  Top 0.254: U2.17 8.71,23.5 6.2,26 6.2,29.1 4.8,30.5 2.66,30.5 J4.3
RC7
  Top 0.254: U2.18 7.52,22.23 7.5,22.2 7.5,23.5 5.1,25.9 5.1,27.2 4.4,27.9 2.68,27.9 J4.4
RDN  (via drill 0.6 pad 0.25)
  Top 0.254: C19.1 37.6,23.79 R11.2 37.62,24.22 38.8,25.4 38.9,25.4 v40.3,26.8 | v42.6,34.9 42.6,35.2 42.3,35.5 42.3,36.68 U1.5
  Bottom 0.254: v40.3,26.8 40.8,26.8 42.5,28.5 42.5,34.8 v42.6,34.9
RDP  (via drill 0.6 pad 0.25)
  Top 0.254: R10.2 33.24,23.82 C18.1 33.27,23.97 34.5,25.2 36.8,25.2 37.4,25.8 37.6,25.8 39.5,27.7 43.1,27.7 v43.4,28 | v44,34.8 44,35 43.3,35.7 43,35.7 42.9,35.8 42.9,36.72 U1.6
  Bottom 0.254: v43.4,28 43.4,34.2 v44,34.8
RESTOMOC
  Top 1.27: R25.P$1 69.06,68.77 OK1.6
RESTOMOC2
  Top 1.27: OK2.6 74.53,21.66 R29.P$1
RST  (via drill 0.6)
  Top 0.254: U1.37 31.05,43.95 29.7,42.6 22.5,42.6 v21.8,41.9 | R2.1 21.7,38.35 v21.7,37 22.5,37 23.8,38.3 J5.1
  Bottom 0.254: v21.8,41.9 21.8,37.1 v21.7,37
SCK  (via drill 0.6)
  Top 0.254: U2.14 18.59,31.19 v18.9,31.5 | U1.33 41.87,47.23 41.1,48 26.7,48 v25.5,49.2
  Bottom 0.254: v18.9,31.5 18.9,31.8 22.5,35.4 25.34,35.4 J3.1 v25.5,49.2
SCSN  (via drill 0.6)
  Top 0.254: U2.11 19.93,22.23 24.3,26.6 24.3,26.74 J3.4 | U1.32 42.37,47.63 41.4,48.6 29.5,48.6 v27.8,50.3
  Top 0.406: J3.4 24.56,27.94 19.7,32.8 17.2,32.8 15.8,34.2 R4.1
  Bottom 0.254: v27.8,50.3 27.8,29 26.8,28 25.56,28 J3.4
TDN
  Top 0.254: J2.8 43.02,20.36 R9.1 43.93,22.13 44.3,22.5 44.3,29.2 40.4,33.1 40.4,36.72 U1.1
TDP
  Top 0.254: J2.7 41.42,17.4 43.1,17.4 45.62,19.92 45.62,21.44 R8.1 45.36,22.14 45.1,22.4 45.1,29 40.9,33.2 40.9,36.72 U1.2
VCC  (via drill 0.6)
  Top 0.254: C14.1 C13.1 4.51,45.98 L1.1 7.1,44 11.01,40.09 | U2.20 7.81,19.68 4.7,22.8 2.7,22.8 J4.6 | U2.20 9.56,19.7 10.8,19.7 12.93,17.57 R5.2 13.1,6.35 13.1,5.4 13.8,4.7 16.3,4.7 17.88,3.12 J1.5 19.72,0.7 26.6,0.7 27.3,1.4 27.3,5 28.05,5.75 R7.1 28.68,7.02 R6.1 | 11.01,40.09 R4.2 18.73,40.09 R3.2 21.8,40.15 R2.2 22.55,40.9 v29.9,40.9 | U2.20 11.79,19.68 13.1,21 13.1,38 11.01,40.09 | R17.1 R19.1 R22.1 31.4,32.6 v30.7,33.3 | U1.28 44.37,47.37 v45.1,48.1 46.51,48.1 | 46.51,48.1 C3.1 | 46.51,48.1 46.51,48.84 C5.1
  Top 0.305: IC1.OUT 20.66,56.86 20.1,56.3 19.15,56.3 C23.1 C24.1 16.2,56.05 16.2,52.4 11.4,47.6 8,47.6 7.09,46.69 L1.1
  Bottom 0.254: v30.7,33.3 30.7,33.6 31.3,34.2 31.3,39.5 v29.9,40.9 37.1,48.1 v45.1,48.1
VCCA  (via drill 0.6, 0.6 pad 0.25)
  Top 0.254: 43.9,39.2 43.2,39.4 42.5,38.8 41.87,38.17 U1.4 41.8,36.68 41.8,33.1 46.32,28.58 v46.32,25.9 R8.2 | 43.9,36.78 U1.8 43.87,37.71 43.58,38 43.58,38.88 43.9,39.2 | 43.9,39.2 44.4,39.3 45,39 45.2,39 45.4,38.8 | 45.4,38.8 45.4,36.78 U1.11 | 45.4,38.8 46.1,39.5 | 46.1,39.5 47.52,39.5 U1.15 | 46.1,39.8 46.1,39.5 | 46.1,39.8 46.1,40.2 46.3,40.4 | 46.3,40.4 47.52,40.4 U1.17 | 46.3,40.4 46.3,42.1 46.6,42.4 47.52,42.4 U1.21 | C10.1 C11.1 16.19,45.92 C9.1 C8.1 11.19,45.89 C4.1 8.91,45.86 L1.2 | C6.1 23.22,45.88 C12.1 25.52,45.93 C7.1 27.85,45.89 C10.1 | C10.1 31.01,45.91 31.4,46.3 38.5,46.3 v38.7,46.1 | v45,40.1 45.8,40.1 46.1,39.8 | J2.6 40.33,20.21 C17.1 41.22,22.12 41.7,22.6 41.7,23.4 42.1,23.8 42.99,23.8 R9.2 43.02,25.58 v43,25.6
  Bottom 0.254: v38.7,46.1 38.7,45.5 39.7,44.5 40.6,44.5 v45,40.1 | v43,25.6 46.02,25.6 v46.32,25.9

### Text on the board
tPlace: AC IN | H | N | Gate | HOT | Neutral | PIC18F26k40 | - | + | LV Input | W5500 | Dev Board | LV Input | + | - | RST | RC4/MISO | RC3/SCK | RC5/MOSI | RC2 | INT | RC6 | RC1 | RC7 | RC0/SS | GND | RA6 | VCC | RA7 | RB0 | GND | RDN | TDN | RB1 | RA5 | RDP | TDP | NEU | HOT | RB2 | RA4 | GATE | RB3 | RA3 | RB4 | RA2 | RB5 | RA1 | PGC | RB6 | RA0 | PGD | VSS | VDD | MCLR | RE3 | RB7 | N | H